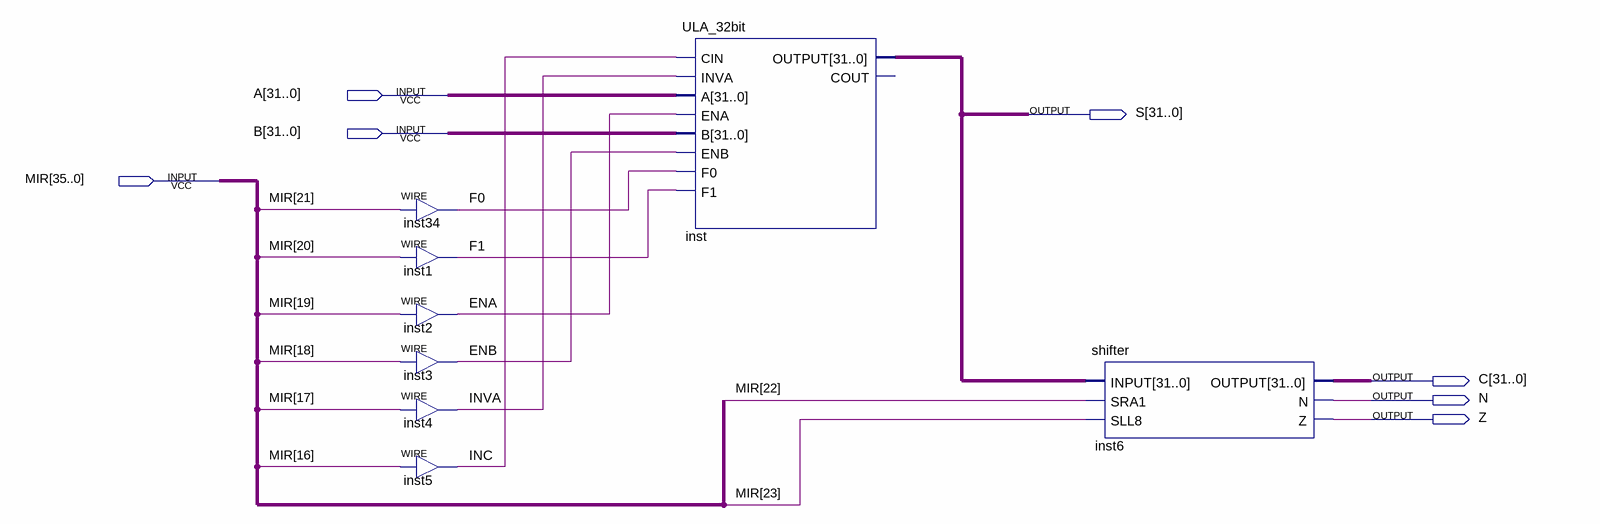
[diagram p0: schematic sheet]
// Quartus schematic ULA_SHIFTER.bdf as structural Verilog: 8 symbols, 7 pins
module ULA_SHIFTER (
  input  [31:0] A,
  input  [31:0] B,
  input  [35:0] MIR,
  output [31:0] S,
  output [31:0] C,
  output N,
  output Z
);

  wire ENA, ENB, F0, F1, INC, INVA;

  assign F0 = MIR[21];  // WIRE inst34
  assign F1 = MIR[20];  // WIRE inst1
  assign ENA = MIR[19];  // WIRE inst2
  assign ENB = MIR[18];  // WIRE inst3
  assign INVA = MIR[17];  // WIRE inst4
  assign INC = MIR[16];  // WIRE inst5
  ULA_32bit inst (
    .CIN(INC), .INVA(INVA), .A(A), .ENA(ENA), .B(B), .ENB(ENB), .F0(F0), .F1(F1), .OUTPUT(S));  // open: COUT
  shifter inst6 (.INPUT(S), .SRA1(MIR[22]), .SLL8(MIR[23]), .OUTPUT(C), .N(N), .Z(Z));
endmodule
